# Altium schematic sheet MP8756GD_3.SchDoc
size A4; SheetNumber: 11; SheetTotal: 16
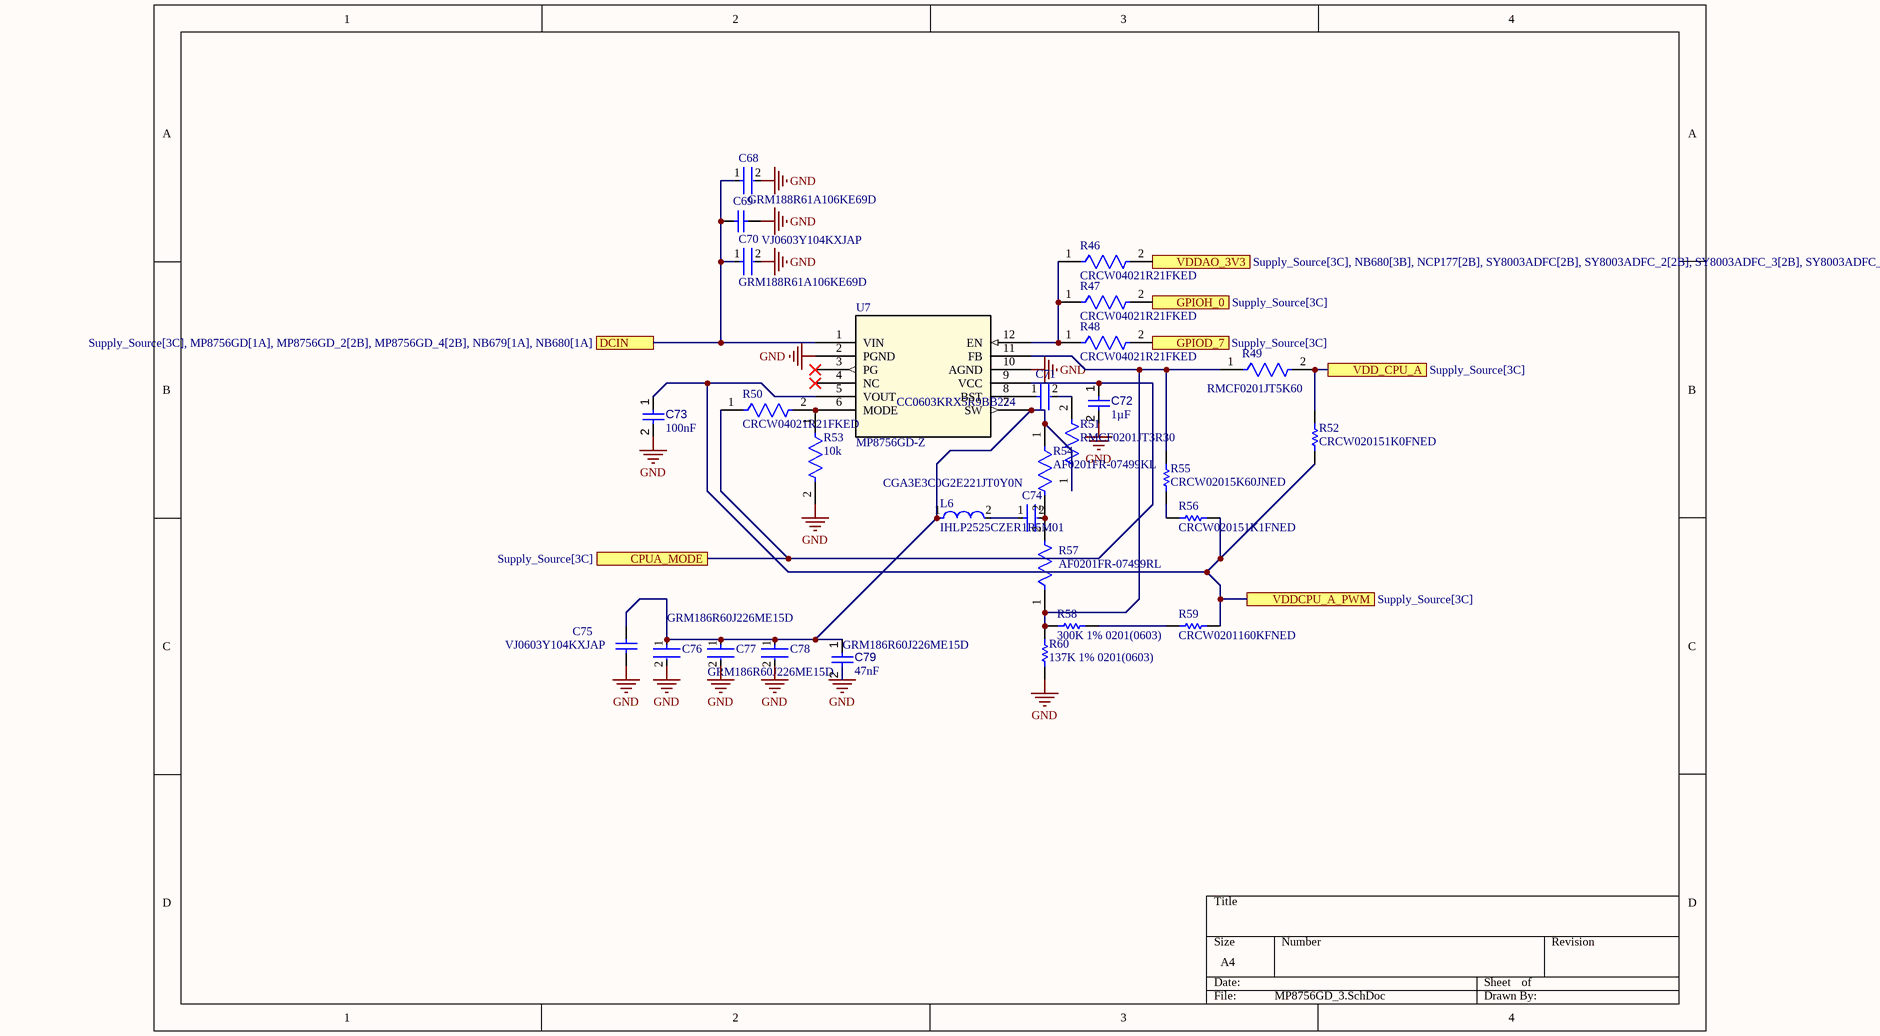
[diagram p0: MP8756GD_3.SchDoc]

## Parts
C68  GRM188R61A106KE69D  [FP-GRM18-0_15-MFG]
C69  VJ0603Y104KXJAP  [CAPC1608X92X38NL15T08]
C70  GRM188R61A106KE69D  [FP-GRM18-0_15-MFG]
C71  CC0603KRX5R9BB224  [FP-CC0603-DA-MFG]
C72  value 1µF  [CAPC1005X55X25LL05T10]  (hidden comment: Capacitor 1 uF +/- 10% 6.3 V 0402)
C73  value 100nF  [CAPC1005X56X25LL10T15]  (hidden comment: Capacitor 0.1 uF +/- 5% 16 V 0402)
C74  CGA3E3C0G2E221JT0Y0N  [FP-CGA3E-0_3-0_1-IPC_B]
C75  VJ0603Y104KXJAP  [CAPC1608X92X38NL15T08]
C76  GRM186R60J226ME15D  [FP-GRM186-0_2-IPC_B]
C77  GRM186R60J226ME15D  [FP-GRM186-0_2-IPC_B]
C78  GRM186R60J226ME15D  [FP-GRM186-0_2-IPC_B]
C79  value 47nF  [CAPC0402(1005)60_L]  (hidden comment: Capacitor 47nF +/-20% 50V 0402)
L6  IHLP2525CZER1R5M01  [FP-IHLP-2525CZ-FP_2_413x3-MFG]
R46  CRCW04021R21FKED  [FP-CRCW0402-e3-MFG]
R47  CRCW04021R21FKED  [FP-CRCW0402-e3-MFG]
R48  CRCW04021R21FKED  [FP-CRCW0402-e3-MFG]
R49  RMCF0201JT5K60  [FP-RMCF0201-MFG]
R50  CRCW04021R21FKED  [FP-CRCW0402-e3-MFG]
R51  RMCF0201JT3R30  [FP-RMCF0201-IPC_A]
R52  CRCW020151K0FNED  [RESC0603X28X15LL05T05]
R53  value 10k  [FP-RT0201-IPC_C]  (hidden comment: RT0201BRE0710KL)
R54  AF0201FR-07499KL  [FP-AF0201-MFG]
R55  CRCW02015K60JNED  [RESC0603X28X15NL05T05]
R56  CRCW020151K1FNED  [RESC0603X28X15ML05T05]
R57  AF0201FR-07499RL  [FP-AF0201-IPC_A]
R58  300K 1% 0201(0603)  [RESC0201(0603)_L]
R59  CRCW0201160KFNED  [RESC0603X28X15ML05T05]
R60  137K 1% 0201(0603)  [RESC0201(0603)_M]
U7  MP8756GD-Z  [QFN-12_MP8756_MNP]

## Ports
CPUA_MODE (see Supply_Source[3C]), DCIN (see Supply_Source[3C], MP8756GD[1A], MP8756GD_2[2B], MP8756GD_4[2B], NB679[1A], NB680[1A]), GPIOD_7 (see Supply_Source[3C]), GPIOH_0 (see Supply_Source[3C]), VDD_CPU_A (see Supply_Source[3C]), VDDAO_3V3 (see Supply_Source[3C], NB680[3B], NCP177[2B], SY8003ADFC[2B], SY8003ADFC_2[2B], SY8003ADFC_3[2B], SY8003ADFC_4[2C], TLV76701[1B]), VDDCPU_A_PWM (see Supply_Source[3C])

## Nets
GND: C68.2 C69.1 C70.2 C72.2 C73.2 C75.1 C76.2 C77.2 C78.2 C79.2 R53.2 R60.1 U7.2(PGND) U7.10(AGND)
CPUA_MODE: C72.1 R50.1 U7.9(VCC) ; port CPUA_MODE
DCIN: C68.1 C69.2 C70.1 U7.1(VIN) ; port DCIN
GPIOD_7: R48.2 ; port GPIOD_7
GPIOH_0: R47.2 ; port GPIOH_0
VDD_CPU_A: R49.2 R52.1 ; port VDD_CPU_A
VDDAO_3V3: R46.2 ; port VDDAO_3V3
VDDCPU_A_PWM: C73.1 R52.2 R56.2 R59.2 U7.5(VOUT) ; port VDDCPU_A_PWM
NetC71_1: C71.1 U7.8(BST)
NetC71_2: C71.2 R51.2
NetC74_1: C74.1 L6.2
NetC74_2: C74.2 R54.2 R57.2
NetC75_2: C75.2 C76.1 C77.1 C78.1 C79.1 L6.1 R51.1 R54.1 U7.7(SW)
NetR46_1: R46.1 R47.1 R48.1 U7.12(EN)
NetR49_1: R49.1 R55.1 R57.1 R58.1 R60.2 U7.11(FB)
NetR50_2: R50.2 R53.1 U7.6(MODE)
NetR55_2: R55.2 R56.1
NetR58_2: R58.2 R59.1

Not connected (* = marked no-connect by the designer): U7 3(PG)* 4(NC)*

## Library data of the parts
C68 C70 = CMP-2000-05448-2: CAP CER 10UF 10V X5R 0603; Manufacturer: Murata; Temperature Coefficient: 15%; Material: Ceramic; Tolerance: 10%; Device Class L1: Passive Components; ComponentLink2Description: Datasheet; Height: 0.95mm; Package: GRM18-0.15; Octopart: https://octopart.com/grm188r61a106ke69d-murata-22851381; Manufacturer Part Number: GRM188R61A106KE69D; Value: 10uF; Digikey Description: CAP CER 10UF 10V X5R 0603; Temperature Range High: +85°C; Temperature Range Low: -55°C; Temperature Characteristic: X5R; Capacitance: 10uF; RoHS: TRUE; Device Class L2: Capacitors; ComponentLink2URL: https://search.murata.co.jp/Ceramy/image/img/A01X/G101/ENG/GRM188R61A106KE69-01A.pdf; Device Class L3: Ceramic Capacitors; Lead Free: Yes; Mouser Description: Multilayer Ceramic Capacitors MLCC - SMD/SMT 0603 10uF 10volts X5R + - 10%; Category: Cap; Voltage Rating: 10V; Temperature: -55°C to +85°C; Automotive: No
C69 C75 = CMP-2006-01211-1: Manufacturer: Vitramon; Part Number: VJ0603Y104KXJAP
C71 = CMP-03422-000839-1: CC0603 220 nF X5R 10.00% 50 V; Manufacturer: YAGEO; Tolerance: 0.1; Capacitance: 220 nF; Temperature Coefficient: 15%; Material: Ceramic; Voltage Rating: 50 V; Value: 220 nF; Package: CC0603-DA; Temperature: -55°C to +125°C; Automotive: No; ComponentLink2URL: http://www.yageo.com/documents/recent/UPY-GPHC_X7R_6.3V-to-50V_18.pdf; Device Class L1: Passive Components; Footprint Url: http://www.yageo.com/exep/pages/download/literatures/UPY-C_GEN_24.pdf; Mouser Description: Surface Mount Ceramic Multilayer Capacitor 0.22uF 10% X5R 50V 0603 Paper T/R; Temperature Range Low: -55°C; ComponentLink2Description: Datasheet; Temperature Characteristic: X5R; Category: Cap; Octopart: https://octopart.com/cc0603krx5r9bb224-yageo-90326743; Device Class L3: Ceramic Capacitors; RoHS: TRUE; Device Class L2: Capacitors; Height: 0.9mm; Manufacturer Part Number: CC0603KRX5R9BB224; Temperature Range High: +125°C; Voltage: 50 V; Lead Free: Yes
C72 = CMP-001-00008-6: Chip Capacitor, 1 uF, +/- 10%, 6.3 V, 0402 (1005 Metric); Capacitor Type: Ceramic; Voltage Rating: 6.3V; Max Operating Temperature: 85°C; Mounting Technology: SM; Tolerance: 10%; Case/Package: 0402; RoHS Compliant: True; Min Operating Temperature: -55°C; Pins: 2
C73 = CMP-001-00001-6: Chip Capacitor, 0.1 uF, +/- 5%, 16 V, 0402 (1005 Metric); Capacitor Type: Ceramic; Voltage Rating: 16V; Max Operating Temperature: 125°C; Min Operating Temperature: -55°C; Case/Package: 0402; Mounting Technology: SM; Pins: 2; Tolerance: 5%; RoHS Compliant: True
C74 = CMP-08246-002038-1: Cap Ceramic 220pF 250V C0G 5% Pad SMD 0603 +125°C Automotive T/R
C76-C78 = CMP-06035-038491-1: Chip Multilayer Ceramic Capacitors for General Purpose, 0603, 22uF, X5R, 15%, 20%, 6.3V; Mount: Surface Mount; Thickness: 0.028inch; Tolerance: 20%; Width: 0.031inch; Voltage Rating (DC): 6.3V; Min Operating Temperature: -55°C; Voltage Rating: 6.3V; Capacitance: 22uF; Dielectric: X5R; Case Code (Imperial): 0603; Length: 0.063inch; Case/Package: 0603; Packaging: Tape and Reel; Case Code (Metric): 1608; Max Operating Temperature: 85°C
C79 = CMP-001-00071-4: Chip Capacitor, 47nF +/-20%, 50V, 0402, Thickness 0.6 mm; Tolerance: 20%; Pins: 2; Mounting Technology: SMT; Voltage Rating: 50V; Case/Package: 0402; Max Operating Temperature: 85°C; Min Operating Temperature: -55°C
L6 = CMP-2000-06441-2: Commercial Inductors, High Saturation Series 1.5uH 9A 15mΩ 20%; DC Resistance (DCR): 15mR; Shielding: Shielded; Self Resonant Frequency: 5MHz; Max DC Current: 18A; Test Frequency: 100kHz; Core Material: Metal; Packaging: Tape and Reel; RMS Current (Irms): 9A; Length: 7.24mm; Case Code (Imperial): 2525; Case/Package: 2525; Min Operating Temperature: -55°C; Number of Pins: 2; Contact Plating: Tin; Height: 3mm; Height - Seated (Max): 0.118inch; Termination: SMD/SMT; Max Operating Temperature: 125°C; Depth: 6.72mm; Width: 6.47mm; Current Rating: 9A; Tolerance: 20%; Lead Free: Lead Free; Military Standard: Not; Radiation Hardening: No; Saturation Current: 18A; Package Quantity: 2000; Inductance Tolerance: 20%; Inductance: 1.5uH; Mount: Surface Mount
R46-R48 R50 = CMP-2002-00308-2: RES Thick Film, 1.21Ω, 1%, 0.063W, 100ppm/°C, 0402; Power Rating: 63mW; Voltage Rating: 50V; Resistance: 1.21R; Height: 0.016inch; Length: 0.039inch; Temperature Coefficient: 100ppm/°C; Case/Package: 0402; Package Quantity: 10; Case Code (Metric): 1005; Radiation Hardening: No; Min Operating Temperature: -55°C; Tolerance: 1%; Weight: 2.3E-05oz; Max Power Dissipation: 63mW; Packaging: Tape and Reel; Composition: Thick Film; Contact Plating: Tin; Termination: SMD/SMT; Case Code (Imperial): 0402; Width: 0.5mm; Features: Automotive AEC-Q200; Number of Terminations: 2; Lead Free: Lead Free; Max Operating Temperature: 155°C
R49 = CMP-26527-005560-1: 5.6kΩ ±5% 0.05W 0201 Thick Film Chip Resistor AEC-Q200 compliant; Max Power Dissipation: 50mW; Resistance: 5.6kR; Temperature Coefficient: 200ppm/°C; Case/Package: 0201; Case Code (Imperial): 0201; Resistor Type: Thick Film; Min Operating Temperature: -55°C; Width: 0.012inch; Contact Plating: Tin; RoHS Compliant: Yes; Packaging: Tape and Reel; Radiation Hardening: No; Case Code (Metric): 0603; Mount: Surface Mount; Length: 0.024inch; Tolerance: 5%; Number of Terminations: 2; Series: RMCF; Max Operating Temperature: 125°C; Height: 0.009inch
R51 = CMP-26527-006332-1: 3.3Ω ±5% 0.05W 0201 Thick Film Chip Resistor AEC-Q200 compliant; Temperature Coefficient: 400ppm/°C; Resistance: 3.3R; Max Power Dissipation: 50mW; Mount: Surface Mount; Resistor Type: Thick Film; Series: RMCF; Tolerance: 5%; Contact Plating: Tin; Max Operating Temperature: 125°C; Radiation Hardening: No; Min Operating Temperature: -55°C; Height: 0.009inch; Number of Terminations: 2; Packaging: Tape and Reel; RoHS Compliant: Yes; Length: 0.024inch; Width: 0.012inch; Case/Package: 0201
R52 = CMP-2004-00692-1: Manufacturer: Vishay Dale; Part Number: CRCW020151K0FNED
R53 = CMP-009-00210-1: Fixed Resistor, Thin Film, 0.05W, 10000ohm, 25V, 0.1% +/-Tol, 50ppm/Cel, Surface Mount, 0201; Max Operating Temperature: 125°C; Min Operating Temperature: -55°C; Case/Package: 0201; Mounting Technology: Surface Mount; Voltage Rating: 25V; Tolerance: 0.1%
R54 = CMP-03412-049532-1: Anti-Sulfurated Chip Resistors Automotive Grade 499kΩ 1% 200ppm/°C 0201; Resistance: 499kR; Max Power Dissipation: 50mW; Packaging: Tape and Reel; Height: 0.01inch; Temperature Coefficient: 200ppm/°C; Width: 0.012inch; Case/Package: 0201; Max Operating Temperature: 125°C; Features: Moisture Resistant; Series: AF; Resistor Type: Thick Film; Min Operating Temperature: -55°C; Length: 0.024inch; Tolerance: 1%; Number of Terminations: 2; RoHS Compliant: Yes
R55 = CMP-2004-00746-1: Manufacturer: Vishay Dale; Part Number: CRCW02015K60JNED
R56 = CMP-2004-00695-1: Manufacturer: Vishay Dale; Part Number: CRCW020151K1FNED
R57 = CMP-03412-047469-1: Anti-Sulfurated Chip Resistors Automotive Grade 499Ω 1% 200ppm/°C 0201; Max Power Dissipation: 50mW; Resistance: 499R; Min Operating Temperature: -55°C; Height: 0.01inch; Features: Moisture Resistant; Resistor Type: Thick Film; Temperature Coefficient: 200ppm/°C; Width: 0.012inch; Case/Package: 0201; Number of Terminations: 2; Max Operating Temperature: 125°C; Packaging: Tape and Reel; Series: AF; RoHS Compliant: Yes; Tolerance: 1%; Length: 0.024inch
R58 = CMP-1010-00694-1: 300K 0.05W 1% 0201 (0603 Metric)  SMD; Case-Metric: 0603; Value: 300000.00 Ohm; Case-EIA: 0201; Power: 0.05 W; Technology: SMT; Tolerance: 1 %
R59 = CMP-2004-00140-1: Manufacturer: Vishay Dale; Part Number: CRCW0201160KFNED
R60 = CMP-1010-00656-1: 137K 0.05W 1% 0201 (0603 Metric)  SMD; Value: 137000.00 Ohm; Case-EIA: 0201; Case-Metric: 0603; Power: 0.05 W; Tolerance: 1 %; Technology: SMT
U7 = CMP-006-000002-1: 26V 6A Low IQ High-Current Synchronous Step-Down Converter; Manufacturer_Name: Monolithic Power Systems; Design Item ID: MP8756GD-Z; RefDes: RefDes; Manufacturer_Part_Number: MP8756GD-Z; Copyright: Copyright (C) 2025 Ultra Librarian. All rights reserved.; Type: Type; Source: MP8756GD-Z.SchLib